# Altium schematic sheet PowerSupply.SchDoc
size A4; SheetNumber: 2; SheetTotal: 6
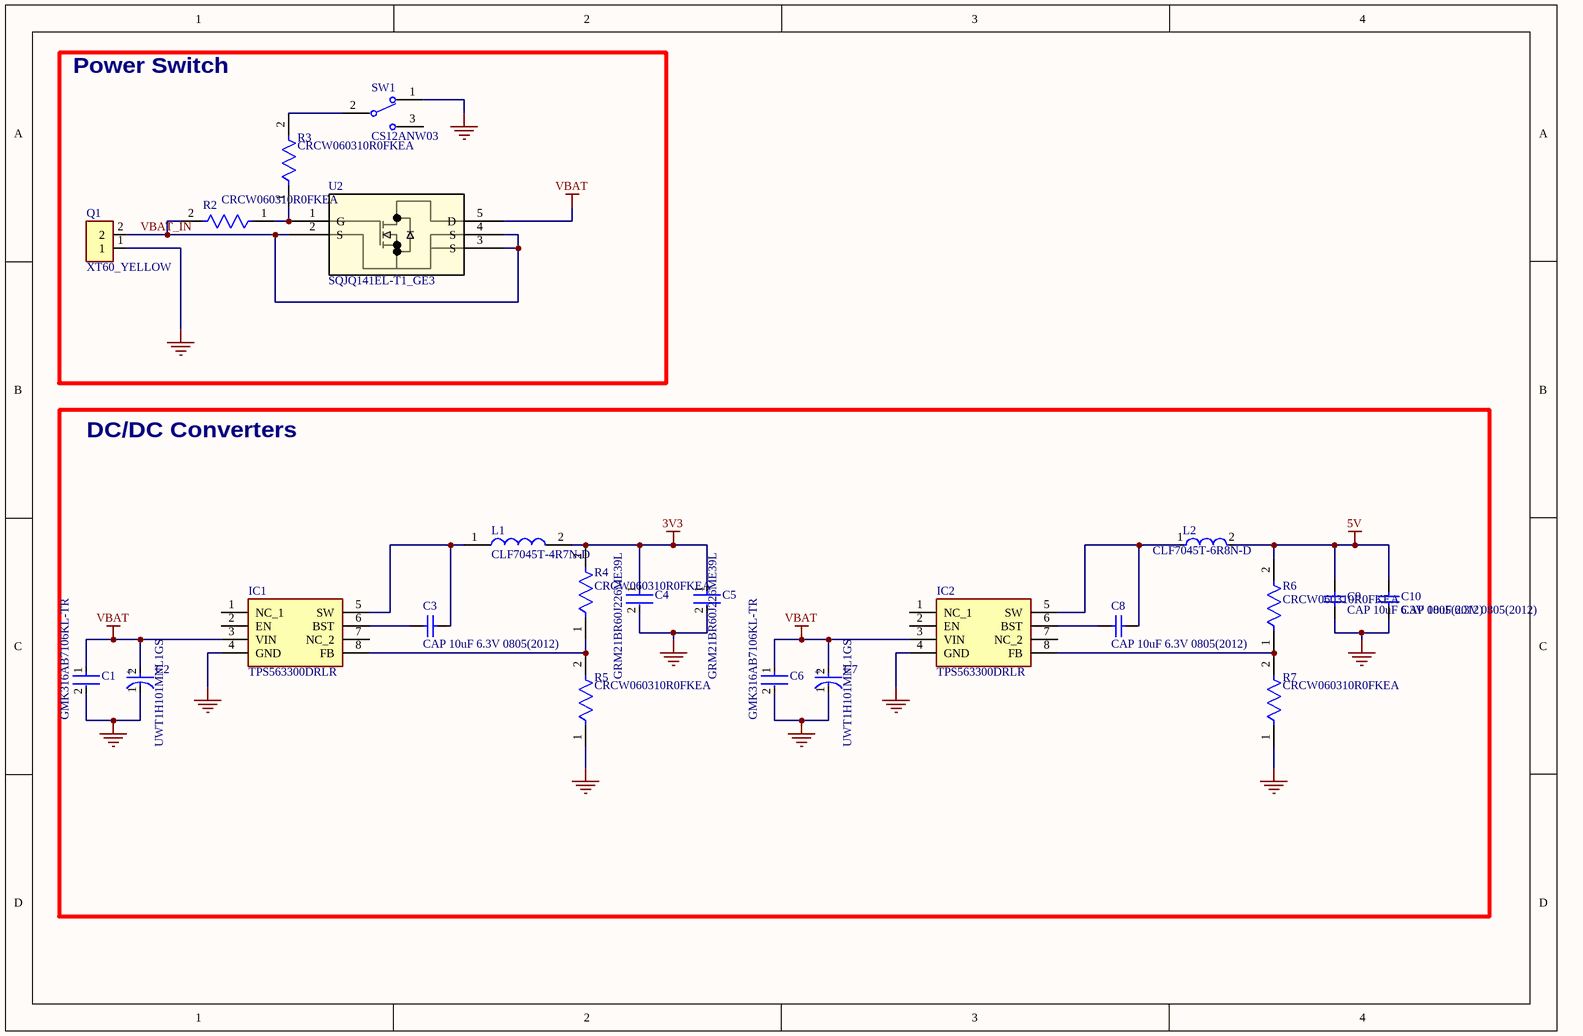
[diagram p0: PowerSupply.SchDoc]

## Parts
C1  GMK316AB7106KL-TR  [FP-1206-L_3_2_0_2-W_1_6_0-IPC_C]
C2  UWT1H101MNL1GS  [FP-UWT1H101MNL1GS-MFG]
C3  CAP 10uF 6.3V 0805(2012)  [CAPC0805(2012)155_L]
C4  GRM21BR60J226ME39L  [FP-GRM21B-0_15-MFG]
C5  GRM21BR60J226ME39L  [FP-GRM21B-0_15-MFG]
C6  GMK316AB7106KL-TR  [FP-1206-L_3_2_0_2-W_1_6_0-IPC_C]
C7  UWT1H101MNL1GS  [FP-UWT1H101MNL1GS-MFG]
C8  CAP 10uF 6.3V 0805(2012)  [CAPC0805(2012)155_L]
C9  CAP 10uF 6.3V 0805(2012)  [CAPC0805(2012)155_L]
C10  CAP 10uF 6.3V 0805(2012)  [CAPC0805(2012)155_L]
IC1  TPS563300DRLR  [SOTFL50P160X60-8N]
IC2  TPS563300DRLR  [SOTFL50P160X60-8N]
L1  CLF7045T-4R7N-D  [CLF7045-D]
L2  CLF7045T-6R8N-D  [FP-CLF7045-MFG]
Q1  XT60_YELLOW  [AMASS_XT60PB-M]
R2  CRCW060310R0FKEA  [FP-CRCW0603-e3-IPC_A]
R3  CRCW060310R0FKEA  [FP-CRCW0603-e3-IPC_A]
R4  CRCW060310R0FKEA  [FP-CRCW0603-e3-IPC_A]
R5  CRCW060310R0FKEA  [FP-CRCW0603-e3-IPC_A]
R6  CRCW060310R0FKEA  [FP-CRCW0603-e3-IPC_A]
R7  CRCW060310R0FKEA  [FP-CRCW0603-e3-IPC_A]
SW1  CS12ANW03  [FP-CS12ANW03-MFG]
U2  SQJQ141EL-T1_GE3  [PowerPAK_8x8L_BWL-2_VIS]

## Blocks framed on the sheet
Power Switch: Q1 R2 R3 SW1 U2
DC/DC Converters: C1-C10 IC1 IC2 L1 L2 R4-R7

## Nets
3V3: C4.1 C5.1 L1.2 R4.2
5V: C9.2 C10.2 L2.2 R6.2
GND: C1.2 C2.1(C) C4.2 C5.2 C6.2 C7.1(C) C9.1 C10.1 IC1.4(GND) IC2.4(GND) Q1.1 R5.1 R7.1 SW1.1
VBAT: C1.1 C2.2(A) C6.1 C7.2(A) IC1.3(VIN) IC2.3(VIN) U2.5(D)
VBAT_IN: Q1.2 R2.2 U2.2(S) U2.3(S) U2.4(S)
NetC3_1: C3.1 IC1.5(SW) L1.1
NetC3_2: C3.2 IC1.6(BST)
NetC8_1: C8.1 IC2.5(SW) L2.1
NetC8_2: C8.2 IC2.6(BST)
NetIC1_8: IC1.8(FB) R4.1 R5.2
NetIC2_8: IC2.8(FB) R6.1 R7.2
NetR2_1: R2.1 R3.1 U2.1(G)
NetR3_2: R3.2 SW1.2(2(COM))

Not connected (* = marked no-connect by the designer): IC1 1(NC_1) 2(EN) 7(NC_2); IC2 1(NC_1) 2(EN) 7(NC_2); SW1 3

## Notes on the sheet
- (in symbol CMP-2000-07373-2) +

## Library data of the parts
C1 C6 = CMP-2000-06324-3: None; Voltage Rating (DC): 35V; Capacitance: 10uF; Tolerance: 10%; Dielectric: X7R; Thickness: 0.071inch; Mount: Surface Mount; Case Code (Imperial): 1206; RoHS Compliant: Yes; Voltage Rating: 35V; Case Code (Metric): 3216; Height: 1.6mm; Packaging: Tape and Reel; Resistor Type: Ceramic; REACH SVHC: No SVHC; Max Operating Temperature: 125°C; Termination: SMD/SMT; Package Quantity: 2000; Width: 1.6mm; Case/Package: 1206; Length: 0.126inch; Series: M; Min Operating Temperature: -55°C
C2 C7 = CMP-2000-07373-2: CAP ALUM 100UF 20% 50V SMD; Leakage Current: 3uA; Ripple Current: 140mA; Life (Hours): 1000Hour; Dissipation Factor: 0.14%; Dielectric Material: Aluminium; Termination: SMD/SMT; Tolerance: 20%; Package Quantity: 500; Capacitance: 100uF; Height: 10mm; REACH SVHC: No SVHC; Case/Package: Radial; Series: WT; Diameter: 8mm; Voltage Rating: 50V; Construction: Cylindrical; Length: 10mm; Min Operating Temperature: -55°C; Max Operating Temperature: 105°C; Voltage Rating (DC): 50V; Packaging: Tape and Reel; Voltage: 50V; Mount: Surface Mount; Ripple Current (AC): 140mA; Radiation Hardening: No; Number of Pins: 2; Lead Free: Lead Free; Height - Seated (Max): 0.413inch; RoHS Compliant: Yes
C3 C8-C10 = CMP-1036-04916-1: CAP 10uF 6.3V ±10% 0805 (2012 Metric) Thickness 1.55mm SMD; Tolerance: Â±10%; Case-Metric: 2012; Case-EIA: 0805; Rated Voltage: 6.3 V; Technology: SMT; Value: 10uF; Max Thickness: 1.55 mm
C4 C5 = CMP-2007-03385-2: Chip Multilayer Ceramic Capacitors for General Purpose, 0805, 22uF, X5R, 15%, 20%, 6.3V; Material: Ceramic; Max Operating Temperature: 85°C; Voltage: 6.3V; Min Operating Temperature: -55°C; Case/Package: 0805; Thickness: 0.053inch; Dielectric: X5R; Packaging: Tape and Reel; Depth: 1.25mm; Termination: SMD/SMT; Voltage Rating (DC): 6.3V; Radiation Hardening: No; Tolerance: 20%; Mount: Surface Mount; Lead Free: Lead Free; Package Quantity: 1; REACH SVHC: No SVHC; Voltage Rating: 6.3V; Capacitance: 22uF; Length: 2mm; Case Code (Imperial): 0805; Case Code (Metric): 2012; Width: 0.049inch; Height: 1.25mm
IC1 IC2 = TPS563300DRLR: Integrated Circuit; Manufacturer_Name: Texas Instruments; Datasheet Link: https://www.ti.com/lit/ds/symlink/tps563300.pdf?ts=1666035990155&ref_url=https%253A%252F%252Fwww.ti.com%252Fproduct%252FTPS563300; Height: 0.6mm; Manufacturer_Part_Number: TPS563300DRLR; Mouser Part Number: 595-TPS563300DRLR; Mouser Price/Stock: https://www.mouser.co.uk/ProductDetail/Texas-Instruments/TPS563300DRLR?qs=vvQtp7zwQdMDxJAw0dSlAg%3D%3D
L1 = CLF7045T-4R7N-D: Inductor; Manufacturer_Name: TDK; Datasheet Link: https://product.tdk.com/system/files/dam/doc/product/inductor/inductor/smd/wdcatalog/withdrawn_inductor_commercial_power_clf7045_en.pdf; Height: 4.8mm; Manufacturer_Part_Number: CLF7045T-4R7N-D; Mouser Part Number: 810-CLF7045T-4R7N-D; Mouser Price/Stock: https://www.mouser.co.uk/ProductDetail/TDK/CLF7045T-4R7N-D?qs=ilIqL0%2F%2FoDU8gjMEHwFGUQ%3D%3D; Arrow Part Number: CLF7045T-4R7N-D; Arrow Price/Stock: https://www.arrow.com/en/products/clf7045t-4r7n-d/tdk
L2 = CMP-08253-000023-1: FIXED IND 6.8UH 3A 27 MOHM SMD; Manufacturer: TDK; Test Frequency: 100kHz; Tolerance: 30%; Core Material: Ferrite; Automotive Grade: Grade 0; Shielding: true; Series Resistance: 35.1mΩ; ComponentLink2Description: Datasheet; Inductance: 6.8uH; Lead Free: Yes; Device Class L3: Fixed Inductors; Rms Current: 3A; Package: CLF7045; Manufacturer Part Number: CLF7045T-6R8N-D; Digikey Description: FIXED IND 6.8UH 3A 27 MOHM SMD; Temperature Range Low: -40°C; ComponentLink2URL: https://product.tdk.com/en/search/inductor/inductor/smd/info/print_pdf; Temperature Range High: +150°C; Device Class L1: Passive Components; Device Class L2: Inductors; Composition: Wirewound; Height: 4.8mm; RoHS: TRUE; Mouser Description: Inductor Power Shielded Wirewound 6.8uH 30% 100KHz Ferrite 3A 35.1mOhm DCR Automotive T/R; Value: 6.8uH; Octopart: https://octopart.com/clf7045t-6r8n-d-tdk-27590387; Temperature: -40°C to +150°C; Automotive: Yes; Category: Ind
Q1 = XT60_YELLOW: Power connector; 65A; PIN: 2; Colour: yellow; MP: XT60 YELLOW; MF: Pololu; SnapEDA_Link: https://www.snapeda.com/parts/XT60%20YELLOW/Pololu/view-part/?ref=snap; Availability: Not in stock; Package: None; Check_prices: https://www.snapeda.com/parts/XT60%20YELLOW/Pololu/view-part/?ref=eda; Value: *; Price: None
R2-R7 = CMP-2000-03845-2: RES Thick Film, 10Ω, 1%, 0.1W, 100ppm/°C, 0603; Resistance: 10R; Voltage Rating (DC): 75V; Power Rating: 100mW; Depth: 0.85mm; Height: 0.45mm; Package Quantity: 10; Temperature Coefficient: 100ppm/°C; Weight: 7.1E-05oz; Case Code (Metric): 1608; Number of Terminations: 2; Features: Automotive AEC-Q200; Termination: SMD/SMT; Lead Free: Lead Free; Mount: Surface Mount; Number of Pins: 2; Tolerance: 1%; Max Power Dissipation: 100mW; Width: 0.033inch; Contact Plating: Tin; Case Code (Imperial): 0603; Max Operating Temperature: 155°C; Min Operating Temperature: -55°C; Voltage Rating: 75V; Length: 1.55mm; Case/Package: 0603; Composition: Thick Film; Packaging: Tape and Reel; Military Standard: Not
SW1 = CMP-31746-000002-1: SWITCH SLIDE SPDT 3A 125V; Max Voltage Rating (AC): 250V; Mechanical Life: 50000Cycles; Switch Travel: 2.2mm; Electrical Life: 20000Cycles; Actuator Length: 5.1mm; Illumination Type: Non-Illuminated; Contact Style: Non-Shorting; Actuator Type: Standard; Actuator Material: Nylon; Switch Function: On-On; Max Operating Temperature: 85°C; Series: CS; Contact Current Rating: 3A; Min Operating Temperature: -30°C; Current Rating: 3A; Mount: Through Hole; Depth: 7.5mm; RoHS Compliant: Yes; Throw Configuration: SPDT; Lead Free: Lead Free; Orientation: Vertical; Contact Plating: Silver; Reach SVHC Compliant: Yes; Termination: PC Pin; Max Current Rating: 3A; Packaging: Tray; Length: 14mm; Package Quantity: 1; Primary Type: SWITCH; Flammability Rating: UL94 V-0; Contact Material: Copper; Voltage Rating (AC): 125V
U2 = SQJQ141EL-T1_GE3: No Description Available; Mfr_Name: Vishay; Copyright: Copyright (C) 2023 Ultra Librarian. All rights reserved.; Manufacturer_Part_Number: SQJQ141EL-T1_GE3; RefDes: RefDes; Type: DEV